# Altium schematic sheet Header.SchDoc
size A4; SheetNumber: 4; SheetTotal: 8
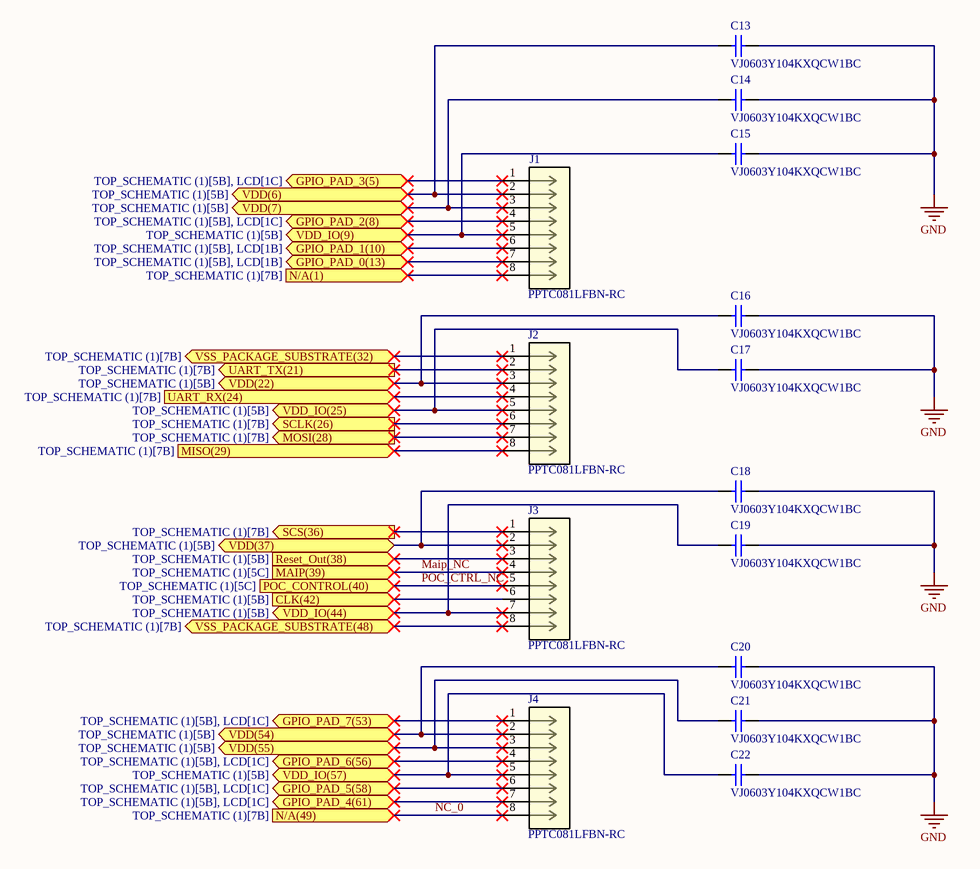
[diagram p0: Header.SchDoc]

## Parts
C13  VJ0603Y104KXQCW1BC  [CAPC1608X95X40NL15T15]
C14  VJ0603Y104KXQCW1BC  [CAPC1608X95X40NL15T15]
C15  VJ0603Y104KXQCW1BC  [CAPC1608X95X40NL15T15]
C16  VJ0603Y104KXQCW1BC  [CAPC1608X95X40NL15T15]
C17  VJ0603Y104KXQCW1BC  [CAPC1608X95X40NL15T15]
C18  VJ0603Y104KXQCW1BC  [CAPC1608X95X40NL15T15]
C19  VJ0603Y104KXQCW1BC  [CAPC1608X95X40NL15T15]
C20  VJ0603Y104KXQCW1BC  [CAPC1608X95X40NL15T15]
C21  VJ0603Y104KXQCW1BC  [CAPC1608X95X40NL15T15]
C22  VJ0603Y104KXQCW1BC  [CAPC1608X95X40NL15T15]
J1  PPTC081LFBN-RC  [CONN_PPTC081LFBN-RC_SUL]
J2  PPTC081LFBN-RC  [CONN_PPTC081LFBN-RC_SUL]
J3  PPTC081LFBN-RC  [CONN_PPTC081LFBN-RC_SUL]
J4  PPTC081LFBN-RC  [CONN_PPTC081LFBN-RC_SUL]

## Ports
CLK(42) (in, see TOP_SCHEMATIC (1)[5B]), GPIO_PAD_0(13) (bidir, see TOP_SCHEMATIC (1)[5B], LCD[1B]), GPIO_PAD_1(10) (bidir, see TOP_SCHEMATIC (1)[5B], LCD[1B]), GPIO_PAD_2(8) (bidir, see TOP_SCHEMATIC (1)[5B], LCD[1C]), GPIO_PAD_3(5) (bidir, see TOP_SCHEMATIC (1)[5B], LCD[1C]), GPIO_PAD_4(61) (bidir, see TOP_SCHEMATIC (1)[5B], LCD[1C]), GPIO_PAD_5(58) (bidir, see TOP_SCHEMATIC (1)[5B], LCD[1C]), GPIO_PAD_6(56) (bidir, see TOP_SCHEMATIC (1)[5B], LCD[1C]), GPIO_PAD_7(53) (bidir, see TOP_SCHEMATIC (1)[5B], LCD[1C]), MAIP(39) (in, see TOP_SCHEMATIC (1)[5C]), MISO(29) (in, see TOP_SCHEMATIC (1)[7B]), MOSI(28) (out, see TOP_SCHEMATIC (1)[7B]), N/A(1) (in, see TOP_SCHEMATIC (1)[7B]), N/A(49) (in, see TOP_SCHEMATIC (1)[7B]), POC_CONTROL(40) (in, see TOP_SCHEMATIC (1)[5C]), Reset_Out(38) (in, see TOP_SCHEMATIC (1)[5B]), SCLK(26) (out, see TOP_SCHEMATIC (1)[7B]), SCS(36) (out, see TOP_SCHEMATIC (1)[7B]), UART_RX(24) (in, see TOP_SCHEMATIC (1)[7B]), UART_TX(21) (out, see TOP_SCHEMATIC (1)[7B]), VDD(6) (bidir, see TOP_SCHEMATIC (1)[5B]), VDD(7) (bidir, see TOP_SCHEMATIC (1)[5B]), VDD(22) (bidir, see TOP_SCHEMATIC (1)[5B]), VDD(37) (bidir, see TOP_SCHEMATIC (1)[5B]), VDD(54) (bidir, see TOP_SCHEMATIC (1)[5B]), VDD(55) (bidir, see TOP_SCHEMATIC (1)[5B]), VDD_IO(9) (bidir, see TOP_SCHEMATIC (1)[5B]), VDD_IO(25) (bidir, see TOP_SCHEMATIC (1)[5B]), VDD_IO(44) (bidir, see TOP_SCHEMATIC (1)[5B]), VDD_IO(57) (bidir, see TOP_SCHEMATIC (1)[5B]), VSS_PACKAGE_SUBSTRATE(32) (bidir, see TOP_SCHEMATIC (1)[7B]), VSS_PACKAGE_SUBSTRATE(48) (bidir, see TOP_SCHEMATIC (1)[7B])

## Nets
GND: C13.2 C14.2 C15.2 C16.2 C17.2 C18.2 C19.2 C20.2 C21.2 C22.2
CLK(42): J3.6 ; port CLK(42)
GPIO_PAD_0(13): J1.7 ; port GPIO_PAD_0(13)
GPIO_PAD_1(10): J1.6 ; port GPIO_PAD_1(10)
GPIO_PAD_2(8): J1.4 ; port GPIO_PAD_2(8)
GPIO_PAD_3(5): J1.1 ; port GPIO_PAD_3(5)
GPIO_PAD_4(61): J4.7 ; port GPIO_PAD_4(61)
GPIO_PAD_5(58): J4.6 ; port GPIO_PAD_5(58)
GPIO_PAD_6(56): J4.4 ; port GPIO_PAD_6(56)
GPIO_PAD_7(53): J4.1 ; port GPIO_PAD_7(53)
Maip_NC: J3.4 ; port MAIP(39)
MISO(29): J2.8 ; port MISO(29)
MOSI(28): J2.7 ; port MOSI(28)
N/A(1): J1.8 ; port N/A(1)
NC_0: J4.8 ; port N/A(49)
POC_CTRL_NC: J3.5 ; port POC_CONTROL(40)
Reset_Out(38): J3.3 ; port Reset_Out(38)
SCLK(26): J2.6 ; port SCLK(26)
SCS(36): J3.1 ; port SCS(36)
UART_RX(24): J2.4 ; port UART_RX(24)
UART_TX(21): J2.2 ; port UART_TX(21)
VDD(6): C13.1 J1.2 ; port VDD(6)
VDD(7): C14.1 J1.3 ; port VDD(7)
VDD(22): C16.1 J2.3 ; port VDD(22)
VDD(37): C18.1 J3.2 ; port VDD(37)
VDD(54): C20.1 J4.2 ; port VDD(54)
VDD(55): C21.1 J4.3 ; port VDD(55)
VDD_IO(9): C15.1 J1.5 ; port VDD_IO(9)
VDD_IO(25): C17.1 J2.5 ; port VDD_IO(25)
VDD_IO(44): C19.1 J3.7 ; port VDD_IO(44)
VDD_IO(57): C22.1 J4.5 ; port VDD_IO(57)
VSS_PACKAGE_SUBSTRATE(32): J2.1 ; port VSS_PACKAGE_SUBSTRATE(32)
VSS_PACKAGE_SUBSTRATE(48): J3.8 ; port VSS_PACKAGE_SUBSTRATE(48)

## Library data of the parts
C13-C22 = CMP-2006-01550-1: Manufacturer: Vitramon; Part Number: VJ0603Y104KXQCW1BC
J1-J4 = PPTC081LFBN-RC: Description; Manufacturer_Name: Sullins; Copyright: Copyright (C) 2026 Ultra Librarian. All rights reserved.; Manufacturer_Part_Number: PPTC081LFBN-RC; RefDes: RefDes; Type: Type